# EAGLE design MBO (EAGLE 7.4.0)
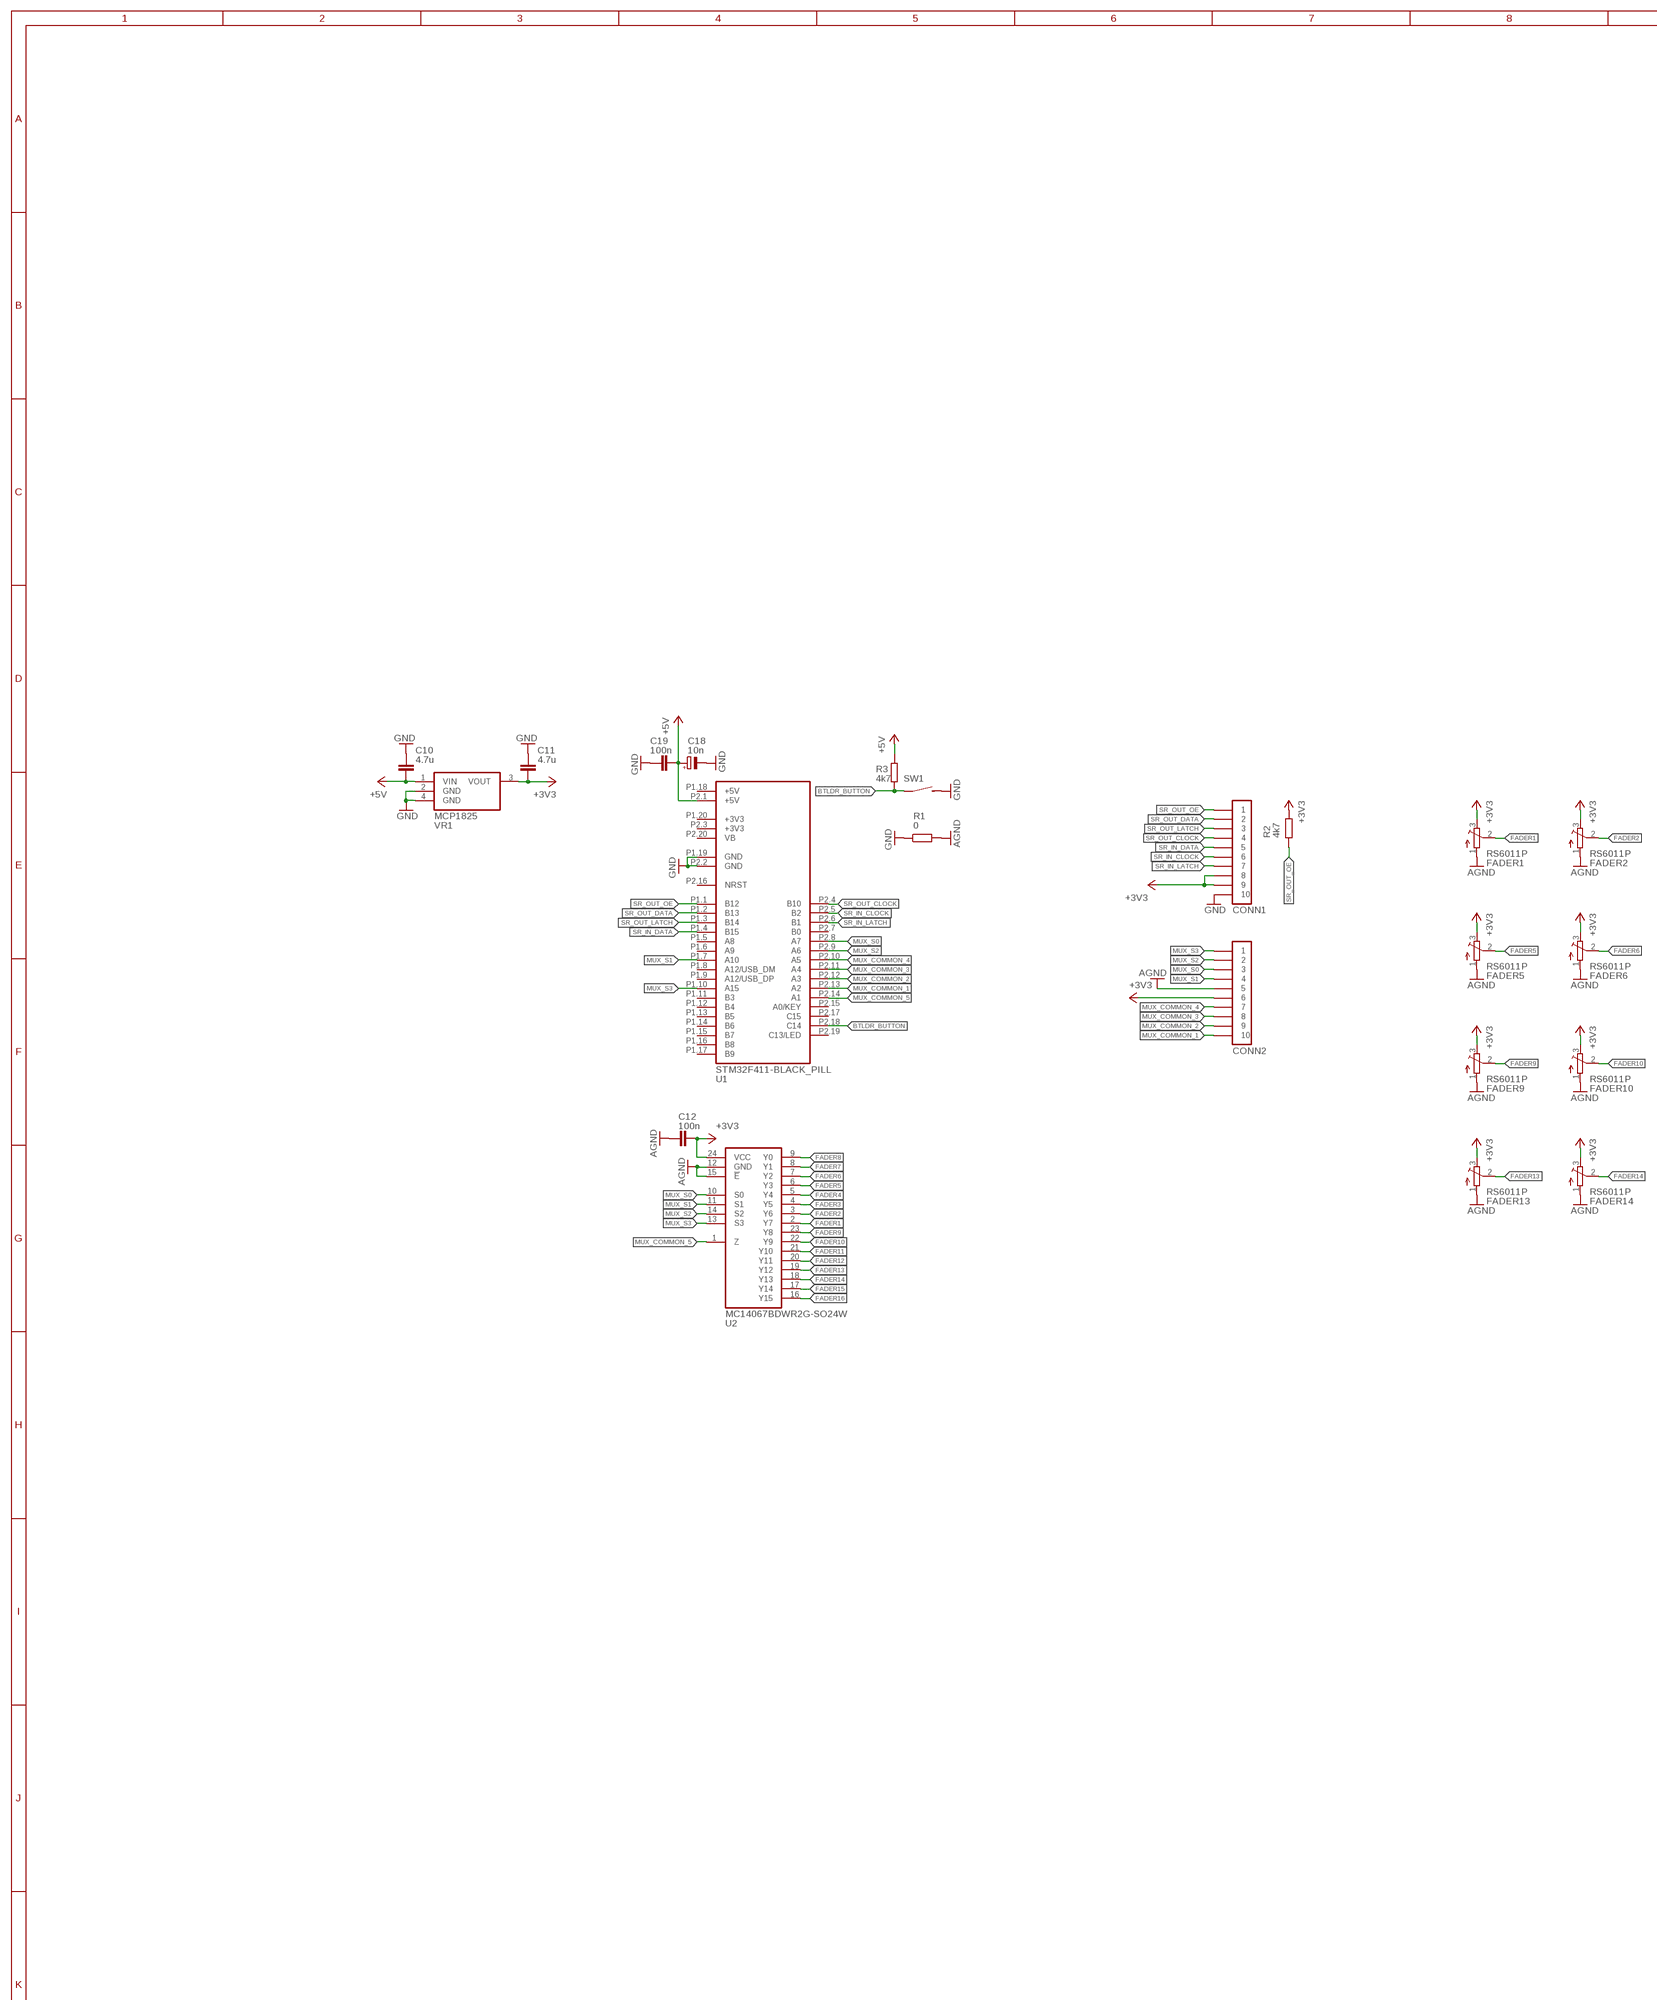
[diagram p0: schematic, sheet 1, part 1 of 3]
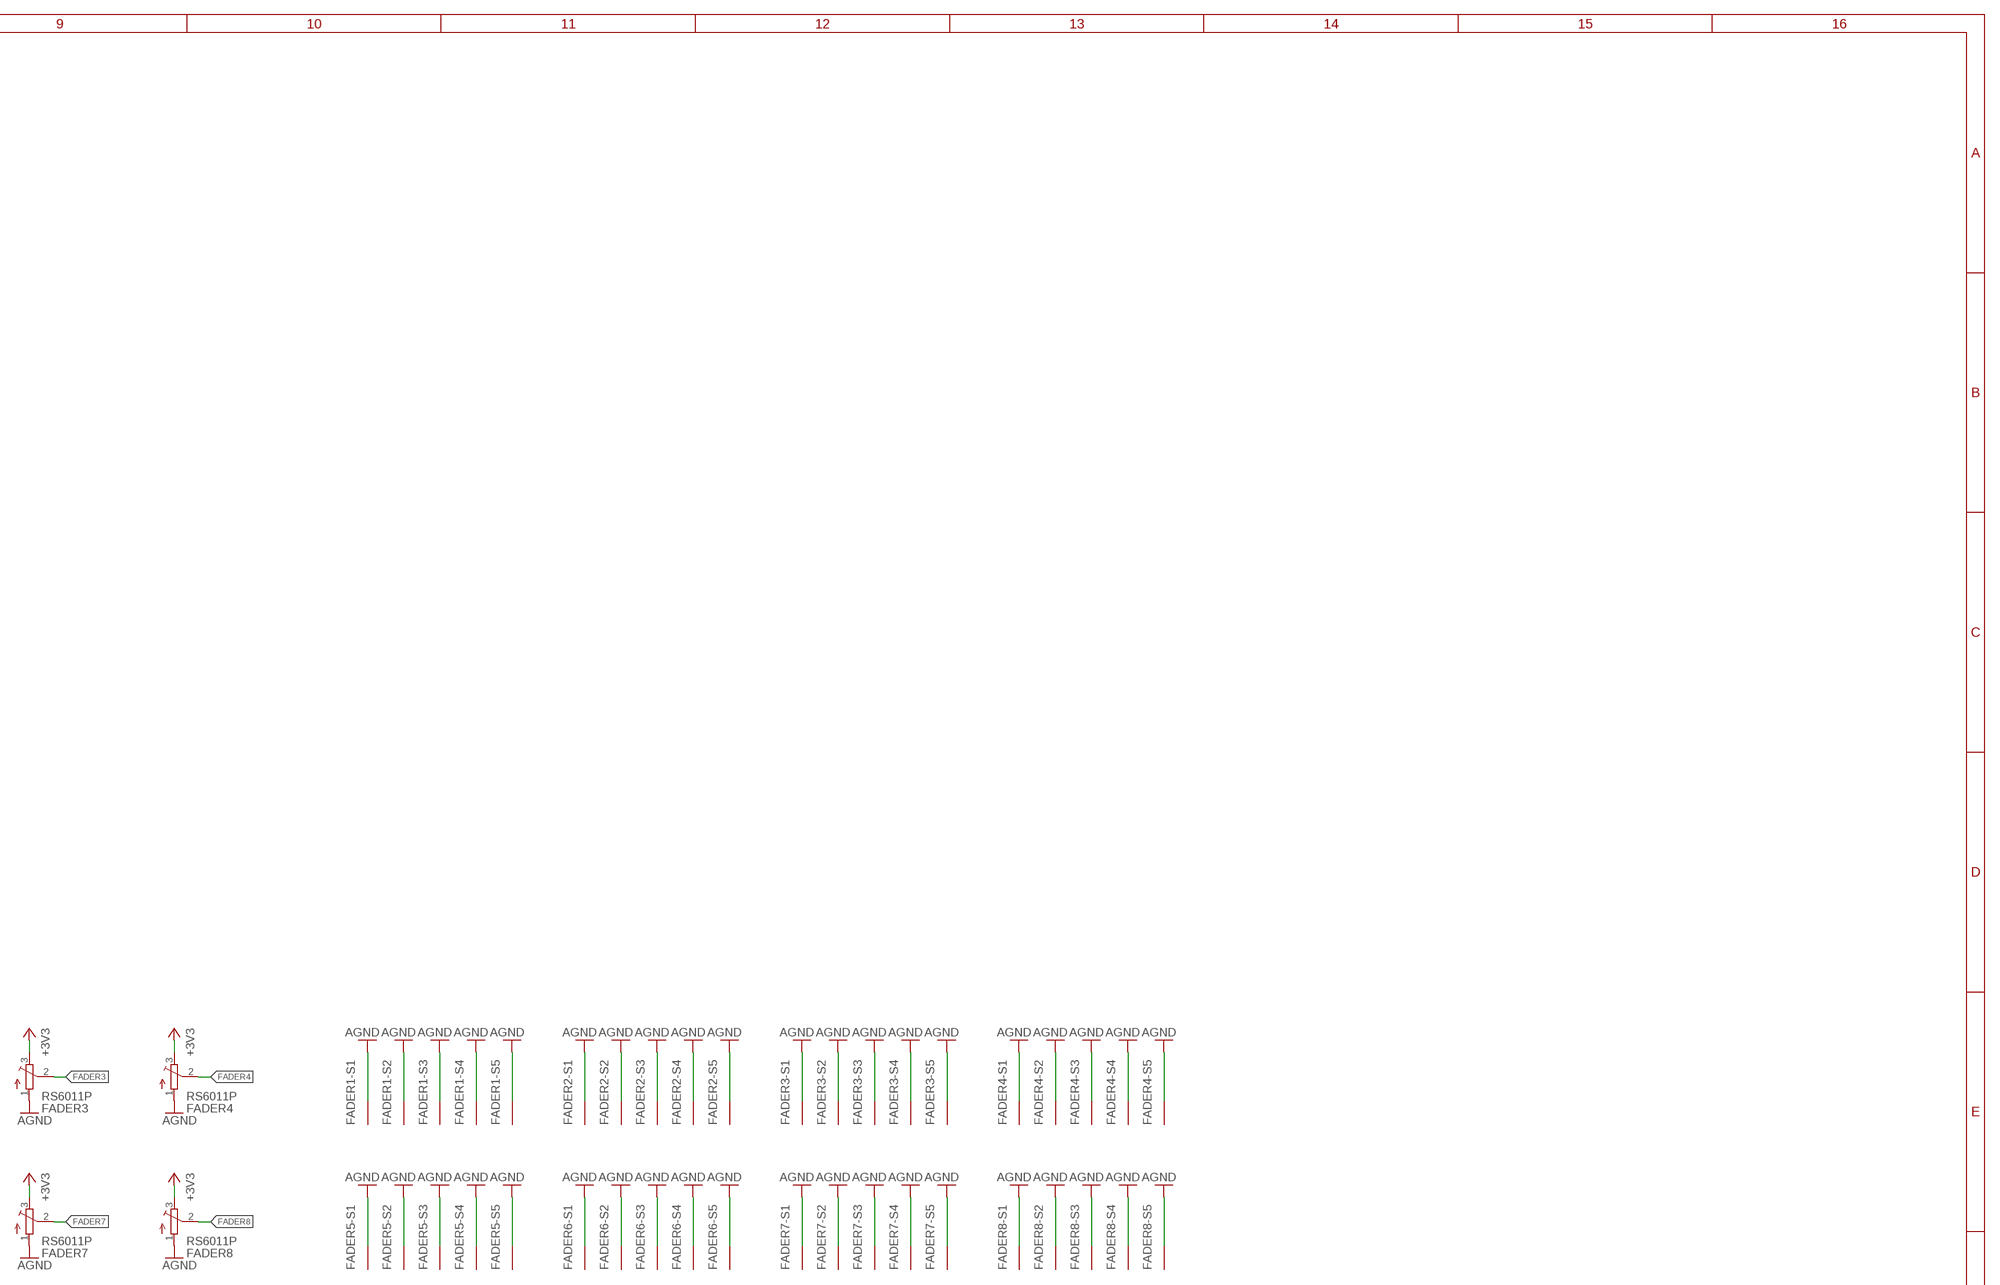
[diagram p1: schematic, sheet 1, part 2 of 3]
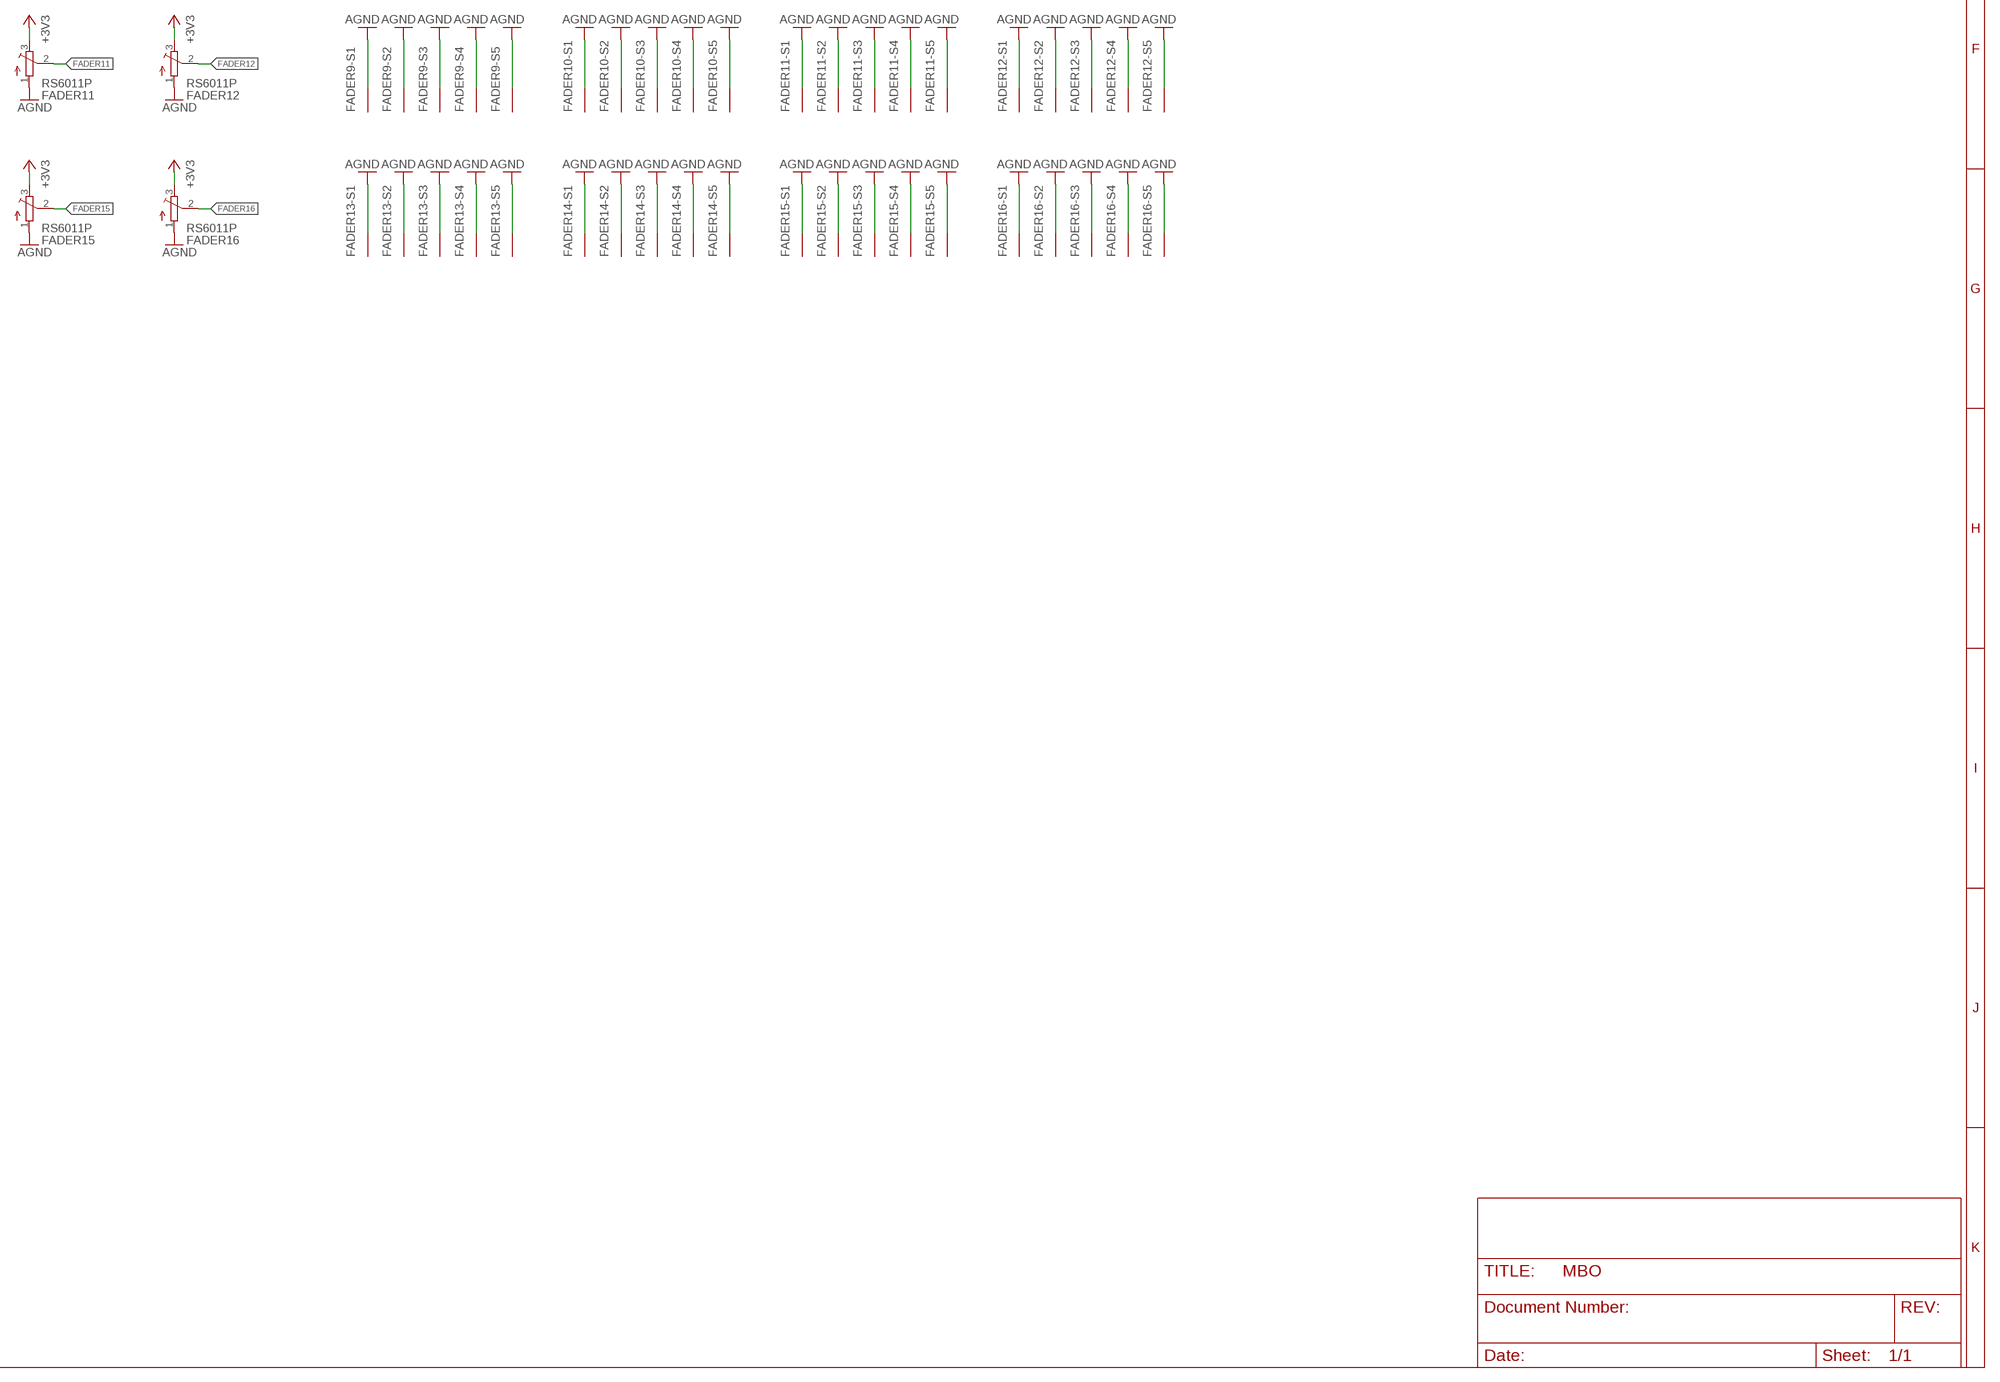
[diagram p2: schematic, sheet 1, part 3 of 3]

## Parts
C10  4.7u  CAPACITOR-0805  [C0805]
C11  4.7u  CAPACITOR-0805  [C0805]
C12  100n  CAPACITOR-0805  [C0805]
C18  10n  ELECTROLYTIC_CAPACITOR-C-TH-E-0401  [C-TH-E-0401]
C19  100n  CAPACITOR-0805  [C0805]
CONN1  PINHD-1X10-FFC-1MM-Z  [MOLEX-52271-1079]
CONN2  PINHD-1X10-FFC-1MM-Z  [MOLEX-52271-1079]
FADER1  RS6011P  [RS6011*P]
FADER2  RS6011P  [RS6011*P]
FADER3  RS6011P  [RS6011*P]
FADER4  RS6011P  [RS6011*P]
FADER5  RS6011P  [RS6011*P]
FADER6  RS6011P  [RS6011*P]
FADER7  RS6011P  [RS6011*P]
FADER8  RS6011P  [RS6011*P]
FADER9  RS6011P  [RS6011*P]
FADER10  RS6011P  [RS6011*P]
FADER11  RS6011P  [RS6011*P]
FADER12  RS6011P  [RS6011*P]
FADER13  RS6011P  [RS6011*P]
FADER14  RS6011P  [RS6011*P]
FADER15  RS6011P  [RS6011*P]
FADER16  RS6011P  [RS6011*P]
R1  0  RESISTOR-0805  [R0805]
R2  4k7  RESISTOR-0805  [R0805]
R3  4k7  RESISTOR-0805  [R0805]
SW1  SWITCH-TACT-TH-6X6MM  [TACT_SW_6X6MM]
U1  STM32F411-BLACK_PILL  [STM32F411-BLACK_PILL]
U2  MC14067BDWR2G-SO24W  [SO24-W]
VR1  MCP1825  [SOT223]

## Nets
+3V3: C11.1 C12.1 CONN1.8 CONN1.9 CONN2.6 FADER1.3 FADER2.3 FADER3.3 FADER4.3 FADER5.3 FADER6.3 FADER7.3 FADER8.3 FADER9.3 FADER10.3 FADER11.3 FADER12.3 FADER13.3 FADER14.3 FADER15.3 FADER16.3 R2.2 U2.24(VCC) VR1.3(VOUT)
+5V: C10.1 C18.+ C19.1 R3.1 U1.P2.1(+5V) VR1.1(VIN)
AGND: C12.2 CONN2.5 FADER1.1 FADER1.S1(S) FADER1.S2(S) FADER1.S3(S) FADER1.S4(S) FADER1.S5(S) FADER2.1 FADER2.S1(S) FADER2.S2(S) FADER2.S3(S) FADER2.S4(S) FADER2.S5(S) FADER3.1 FADER3.S1(S) FADER3.S2(S) FADER3.S3(S) FADER3.S4(S) FADER3.S5(S) FADER4.1 FADER4.S1(S) FADER4.S2(S) FADER4.S3(S) FADER4.S4(S) FADER4.S5(S) FADER5.1 FADER5.S1(S) FADER5.S2(S) FADER5.S3(S) FADER5.S4(S) FADER5.S5(S) FADER6.1 FADER6.S1(S) FADER6.S2(S) FADER6.S3(S) FADER6.S4(S) FADER6.S5(S) FADER7.1 FADER7.S1(S) FADER7.S2(S) FADER7.S3(S) FADER7.S4(S) FADER7.S5(S) FADER8.1 FADER8.S1(S) FADER8.S2(S) FADER8.S3(S) FADER8.S4(S) FADER8.S5(S) FADER9.1 FADER9.S1(S) FADER9.S2(S) FADER9.S3(S) FADER9.S4(S) FADER9.S5(S) FADER10.1 FADER10.S1(S) FADER10.S2(S) FADER10.S3(S) FADER10.S4(S) FADER10.S5(S) FADER11.1 FADER11.S1(S) FADER11.S2(S) FADER11.S3(S) FADER11.S4(S) FADER11.S5(S) FADER12.1 FADER12.S1(S) FADER12.S2(S) FADER12.S3(S) FADER12.S4(S) FADER12.S5(S) FADER13.1 FADER13.S1(S) FADER13.S2(S) FADER13.S3(S) FADER13.S4(S) FADER13.S5(S) FADER14.1 FADER14.S1(S) FADER14.S2(S) FADER14.S3(S) FADER14.S4(S) FADER14.S5(S) FADER15.1 FADER15.S1(S) FADER15.S2(S) FADER15.S3(S) FADER15.S4(S) FADER15.S5(S) FADER16.1 FADER16.S1(S) FADER16.S2(S) FADER16.S3(S) FADER16.S4(S) FADER16.S5(S) R1.2 U2.12(GND) U2.15(!E)
BTLDR_BUTTON: R3.2 SW1.A1 U1.P2.18(C14)
FADER1: FADER1.2 U2.2(Y7)
FADER2: FADER2.2 U2.3(Y6)
FADER3: FADER3.2 U2.4(Y5)
FADER4: FADER4.2 U2.5(Y4)
FADER5: FADER5.2 U2.6(Y3)
FADER6: FADER6.2 U2.7(Y2)
FADER7: FADER7.2 U2.8(Y1)
FADER8: FADER8.2 U2.9(Y0)
FADER9: FADER9.2 U2.23(Y8)
FADER10: FADER10.2 U2.22(Y9)
FADER11: FADER11.2 U2.21(Y10)
FADER12: FADER12.2 U2.20(Y11)
FADER13: FADER13.2 U2.19(Y12)
FADER14: FADER14.2 U2.18(Y13)
FADER15: FADER15.2 U2.17(Y14)
FADER16: FADER16.2 U2.16(Y15)
GND: C10.2 C11.2 C18.- C19.2 CONN1.10 R1.1 SW1.B1 U1.P1.19(GND) U1.P2.2(GND) VR1.2(GND) VR1.4(GND)
MUX_COMMON_1: CONN2.10 U1.P2.13(A2)
MUX_COMMON_2: CONN2.9 U1.P2.12(A3)
MUX_COMMON_3: CONN2.8 U1.P2.11(A4)
MUX_COMMON_4: CONN2.7 U1.P2.10(A5)
MUX_COMMON_5: U1.P2.14(A1) U2.1(Z)
MUX_S0: CONN2.3 U1.P2.8(A7) U2.10(S0)
MUX_S1: CONN2.4 U1.P1.7(A10) U2.11(S1)
MUX_S2: CONN2.2 U1.P2.9(A6) U2.14(S2)
MUX_S3: CONN2.1 U1.P1.10(A15) U2.13(S3)
SR_IN_CLOCK: CONN1.6 U1.P2.5(B2)
SR_IN_DATA: CONN1.5 U1.P1.4(B15)
SR_IN_LATCH: CONN1.7 U1.P2.6(B1)
SR_OUT_CLOCK: CONN1.4 U1.P2.4(B10)
SR_OUT_DATA: CONN1.2 U1.P1.2(B13)
SR_OUT_LATCH: CONN1.3 U1.P1.3(B14)
SR_OUT_OE: CONN1.1 R2.1 U1.P1.1(B12)
Unconnected: U1.P1.5(A8) U1.P1.6(A9) U1.P1.8(A12/USB_DM) U1.P1.9(A12/USB_DP) U1.P1.11(B3) U1.P1.12(B4) U1.P1.13(B5) U1.P1.14(B6) U1.P1.15(B7) U1.P1.16(B8) U1.P1.17(B9) U1.P1.18(+5V) U1.P1.20(+3V3) U1.P2.3(+3V3) U1.P2.7(B0) U1.P2.15(A0/KEY) U1.P2.16(NRST) U1.P2.17(C15) U1.P2.19(C13/LED) U1.P2.20(VB)

## Library data of the parts
C10-C12 C19 = igor_lbr:CAPACITOR: Capacitor
C18 = igor_lbr:ELECTROLYTIC_CAPACITOR: Electrolytic capacitor
CONN1 CONN2 = igor_lbr:PINHD-1X10: Pin header; MANUFACTURER: Molex; MPN: 52271-1079
FADER1-FADER16 = igor_lbr:RS6011*P: Potentiometer
R1-R3 = igor_lbr:RESISTOR: Resistor
SW1 = igor_lbr:SWITCH: Switch
U1 = igor_lbr:STM32F411-BLACK_PILL: STM32F411 Black Pill development board
U2 = igor_lbr:MC14067BDWR2G: 16-Channel Analog Multiplexer/Demultiplexer; MANUFACTURER: ON Semiconductor; MPN: MC14067BDWR2G
VR1 = igor_lbr:MCP1825: 500 mA, Low Voltage, Low Quiescent Current LDO Regulator; MANUFACTURER: Microchip; MPN: MCP1825S-3302E/DB

## Board
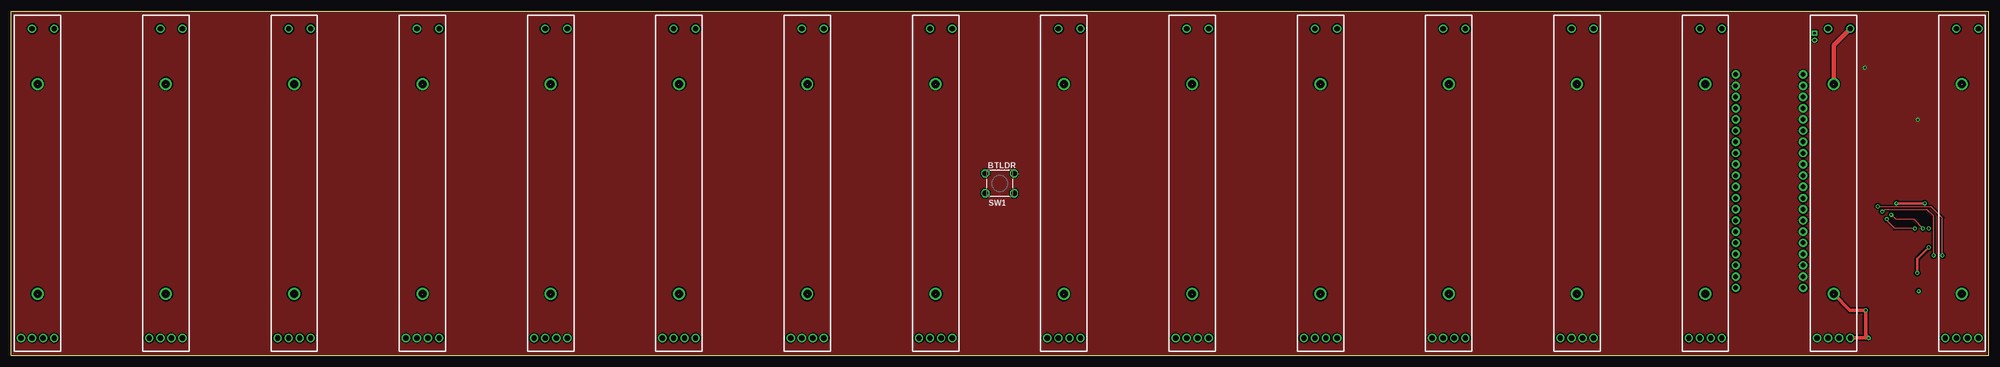
[diagram p3: board, top side]
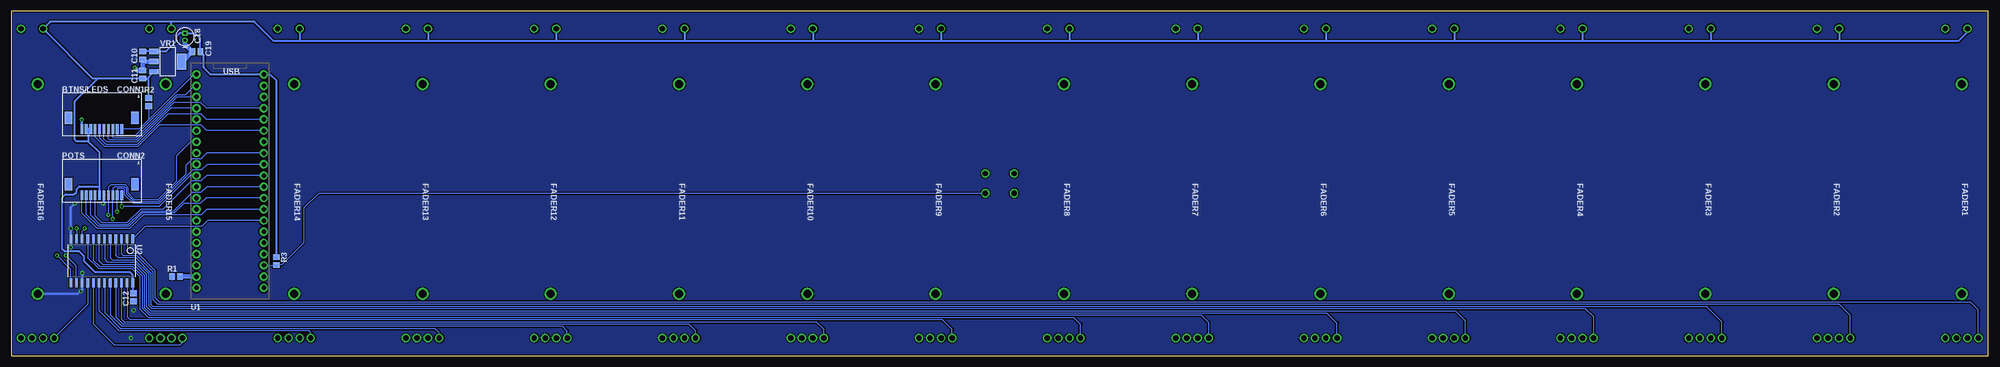
[diagram p4: board, bottom side, seen from below]

Size 447 x 78 mm. Coordinates in mm from the lower left corner, seen from the top.
Outline: 0,0 0,78 447,78 447,0 0,0
Copper layers (1*16): Top 0.035mm / dielectric 1.5mm / Bottom 0.035mm
Design rules "smiery *": minimum track width 8mil, minimum drill 12mil, track to track 6mil, track to pad 5mil, pad to pad 5mil, via to via 6mil, smd to smd 0mil, copper to edge 12mil, drill to drill 10mil, minimum pad ring 13mil, minimum via ring 10mil, stop-mask expansion 2mil, vias tented up to drill 25mil, thermal gap 10mil

### Footprints (pad centres in the part's own frame; a part is rotated, then mirrored left to right if it is on the bottom)
C0805 = smd 1.27 x 1.524: 1 -0.9,0; 2 0.9,0
C-TH-E-0401 = drill 0.5 square: + 0.77,0 | drill 0.5: - -0.77,0
MOLEX-52271-1079 = smd 0.6 x 2.2: 1 -4.5,3.5; 2 -3.5,3.5; 3 -2.5,3.5; 4 -1.5,3.5; 5 -0.5,3.5; 6 0.5,3.5; 7 1.5,3.5; 8 2.5,3.5; 9 3.5,3.5; 10 4.5,3.5 | smd 1.65 x 2.8: S1 -7.5,1; S2 7.5,1
RS6011*P = drill 1.2: 1 -35,1.25; 2 -35,3.75; 3 35,1.25; S1 -35,-1.25; S2 -35,-3.75; S5 35,-3.75 | drill 1.8: S3 -25,0; S4 22.5,0
R0805 = smd 1.27 x 1.524: 1 -0.9,0; 2 0.9,0
TACT_SW_6X6MM = drill 1.2 octagon: A1 3.25,-2.25; A2 -3.25,-2.25; B1 3.25,2.25; B2 -3.25,2.25
STM32F411-BLACK_PILL = drill 1.016 pad 1.88: P1.1 -7.62,24.13; P1.2 -7.62,21.59; P1.3 -7.62,19.05; P1.4 -7.62,16.51; P1.5 -7.62,13.97; P1.6 -7.62,11.43; P1.7 -7.62,8.89; P1.8 -7.62,6.35; P1.9 -7.62,3.81; P1.10 -7.62,1.27; P1.11 -7.62,-1.27; P1.12 -7.62,-3.81; P1.13 -7.62,-6.35; P1.14 -7.62,-8.89; P1.15 -7.62,-11.43; P1.16 -7.62,-13.97; P1.17 -7.62,-16.51; P1.18 -7.62,-19.05; P1.19 -7.62,-21.59; P1.20 -7.62,-24.13; P2.1 7.62,24.13; P2.2 7.62,21.59; P2.3 7.62,19.05; P2.4 7.62,16.51; P2.5 7.62,13.97; P2.6 7.62,11.43; P2.7 7.62,8.89; P2.8 7.62,6.35; P2.9 7.62,3.81; P2.10 7.62,1.27; P2.11 7.62,-1.27; P2.12 7.62,-3.81; P2.13 7.62,-6.35; P2.14 7.62,-8.89; P2.15 7.62,-11.43; P2.16 7.62,-13.97; P2.17 7.62,-16.51; P2.18 7.62,-19.05; P2.19 7.62,-21.59; P2.20 7.62,-24.13
SO24-W = smd 2.032 x 0.6: 1 -4.975,6.985; 2 -4.975,5.715; 3 -4.975,4.445; 4 -4.975,3.175; 5 -4.975,1.905; 6 -4.975,0.635; 7 -4.975,-0.635; 8 -4.975,-1.905; 9 -4.975,-3.175; 10 -4.975,-4.445; 11 -4.975,-5.715; 12 -4.975,-6.985; 13 4.975,-6.985; 14 4.975,-5.715; 15 4.975,-4.445; 16 4.975,-3.175; 17 4.975,-1.905; 18 4.975,-0.635; 19 4.975,0.635; 20 4.975,1.905; 21 4.975,3.175; 22 4.975,4.445; 23 4.975,5.715; 24 4.975,6.985
SOT223 = smd 2.235 x 1.219: 1 -3.099,2.311; 2 -3.099,0; 3 -3.099,-2.311 | smd 2.2 x 3.6: 4 3.099,0

### Placement (x,y rotation side)
C10  417.25,67.95 270 bottom
C11  417.25,63.65 90 bottom
C12  419.3,13.2 270 bottom
C18  407.7,72.2 90 bottom
C19  405.1,68.8 180 bottom
CONN1  426.5,54.8 180 bottom
CONN2  426.5,39.8 180 bottom
FADER1  6,39 90 top
FADER2  35,39 90 top
FADER3  64,39 90 top
FADER4  93,39 90 top
FADER5  122,39 90 top
FADER6  151,39 90 top
FADER7  180,39 90 top
FADER8  209,39 90 top
FADER9  238,39 90 top
FADER10  267,39 90 top
FADER11  296,39 90 top
FADER12  325,39 90 top
FADER13  354,39 90 top
FADER14  383,39 90 top
FADER15  412,39 90 top
FADER16  441,39 90 top
R1  409.7,17.9 180 bottom
R2  415.9,57.4 90 bottom
R3  387,21.4 270 bottom
SW1  223.5,39 0 top
U1  397.5,39.5 0 bottom
U2  426.5,21.5 270 bottom
VR1  411.6,66.59 0 bottom

### Tracks (layer width: path | path; a pad name or v marks a point on that pad's centre or on a via)
+3V3
  Bottom 0.406: CONN1.9 429.5,51.3 | 429.5,51.3 CONN1.8 | FADER1.3 4.75,73.25 6.8,71.2 33.8,71.2 | 33.8,71.2 62.7,71.2 | FADER2.3 33.75,71.25 33.8,71.2 | FADER3.3 62.75,71.25 62.7,71.2 | 149.8,71.2 178.7,71.2 | FADER6.3 149.75,71.25 149.8,71.2 | FADER7.3 178.75,71.25 178.7,71.2 | 265.8,71.2 294.7,71.2 | FADER10.3 265.75,71.25 265.8,71.2 | FADER11.3 294.75,71.25 294.7,71.2 | FADER14.3 381.75,71.25 381.8,71.2 | C12.1 419.51,14.31 U2.24 419.51,18.32 420.1,18.9 428,18.9 430.5,21.4 430.5,22.5 431.6,23.6 434.9,23.6 435.4,24.1 435.4,35.8 434.7,36.5 432.8,36.5 432.2,37.1 432.2,37.7 431.6,38.3 427.1,38.3 427,38.4 | 62.7,71.2 91.7,71.2 | 91.7,71.2 120.7,71.2 | 120.7,71.2 149.8,71.2 | 178.7,71.2 207.7,71.2 | 207.7,71.2 236.7,71.2 | 236.7,71.2 265.8,71.2 | 294.7,71.2 323.8,71.2 | 323.8,71.2 352.7,71.2 | 352.7,71.2 381.8,71.2 | FADER4.3 91.75,71.25 91.7,71.2 | FADER5.3 120.75,71.25 120.7,71.2 | FADER8.3 207.75,71.25 207.7,71.2 | FADER9.3 236.75,71.25 236.7,71.2 | FADER12.3 323.75,71.25 323.8,71.2 | FADER13.3 352.75,71.25 352.7,71.2 | CONN2.6 427,38.4 | 427,38.4 427,46 429.5,48.5 | 381.8,71.2 387.6,71.2 392,75.6 410.8,75.6 | 429.5,48.5 432.2,48.5 432.6,48.9 432.6,57.6 427.45,62.75 | 429.5,51.3 429.5,48.5 | 416.23,62.75 C11.1 427.45,62.75 | VR1.3 416.23,62.75 | R2.2 415.9,62.42 416.23,62.75 | 427.45,62.75 428.5,62.75 FADER16.3 438.15,75.6 410.8,75.6 | FADER15.3 410.75,75.55 410.8,75.6
+5V
  Bottom 0.406: R3.1 387,62.2 388.43,63.63 U1.P2.1 401.83,63.63 403.4,65.2 403.4,68 C19.1 404.2,71.8 405.37,72.97 C18.+ 408.83,72.97 409.5,72.3 409.5,71.3 411.9,68.9 VR1.1 417.2,68.9 C10.1
AGND  (via drill 0.4 pad 0.6)
  Top 0.61: v430.9,18.7 430.9,21.9 v433.5,24.5 | v426.2,34.5 v432.6,34.5
  Top 0.813: FADER15.S3 415.7,10.3 v419.3,10.3 419.3,4.6 v419.9,4 FADER15.S2
  Top 1.016: FADER15.S4 412,70.25 FADER15.S5
  Bottom 0.61: FADER16.S3 431.9,14 430.94,14.96 U2.15 430.94,18.66 v430.9,18.7 | v433.5,24.5 433.49,24.52 U2.12 433.49,28.79 v433.5,28.8 433.5,33.6 v432.6,34.5 | CONN2.5 426,34.7 v426.2,34.5
  other vias: 431.2,14.6
  pour Bottom (isolate 0.305): 0,78 447,78 447,0 0,0
BTLDR_BUTTON
  Bottom 0.203: SW1.A1 377.45,36.75 380.8,33.4 380.8,25.5 385.8,20.5 R3.2 387.05,20.45 U1.P2.18
FADER1
  Bottom 0.254: U2.2 420.79,23.59 420.3,23.1 418.3,23.1 414.4,19.2 414.4,13.1 413.4,12.1 4,12.1 2.25,10.35 FADER1.2
FADER2
  Bottom 0.254: U2.3 422.06,23.16 421.5,22.6 418.5,22.6 414.9,19 414.9,12.7 413.8,11.6 33.7,11.6 31.25,9.15 FADER2.2
FADER3
  Bottom 0.254: U2.4 423.32,22.73 422.7,22.1 418.7,22.1 415.4,18.8 415.4,11.6 414.9,11.1 63.7,11.1 60.25,7.65 FADER3.2
FADER4
  Bottom 0.254: U2.5 424.6,22.2 424,21.6 418.9,21.6 415.9,18.6 415.9,11.4 415.1,10.6 91.1,10.6 89.25,8.75 FADER4.2
FADER5
  Bottom 0.254: U2.6 425.87,21.86 425.1,21.1 419,21.1 416.4,18.5 416.4,11.2 415.3,10.1 120.4,10.1 118.25,7.95 FADER5.2
FADER6
  Bottom 0.254: U2.7 427.13,21.54 426.2,20.6 419.2,20.6 416.9,18.3 416.9,11 415.5,9.6 149.5,9.6 147.25,7.35 FADER6.2
FADER7
  Bottom 0.254: U2.8 428.4,21.61 426.9,20.1 419.4,20.1 417.4,18.1 417.4,10.8 415.7,9.1 177.9,9.1 176.25,7.45 FADER7.2
FADER8
  Bottom 0.254: U2.9 429.68,22.18 427.1,19.6 419.6,19.6 417.9,17.9 417.9,10.6 415.9,8.6 206.7,8.6 205.25,7.15 FADER8.2
FADER9
  Bottom 0.254: U2.23 420.79,8.79 420.1,8.1 236.4,8.1 234.25,5.95 FADER9.2
FADER10
  Bottom 0.254: U2.22 422.06,8.36 421.3,7.6 264.9,7.6 263.25,5.95 FADER10.2
FADER11
  Bottom 0.254: U2.21 423.32,8.82 421.6,7.1 293.7,7.1 292.25,5.65 FADER11.2
FADER12
  Bottom 0.254: U2.20 424.6,9.29 421.9,6.6 322.3,6.6 321.25,5.55 FADER12.2
FADER13
  Bottom 0.254: U2.19 425.87,9.77 422.2,6.1 351.1,6.1 350.25,5.25 FADER13.2
FADER14
  Bottom 0.254: U2.18 427.13,10.23 422.5,5.6 379.6,5.6 379.25,5.25 FADER14.2
FADER15
  Bottom 0.254: FADER15.2 408.25,3.05 408.9,2.4 423.6,2.4 428.4,7.21 U2.17
FADER16
  Bottom 0.254: U2.16 429.68,11.57 FADER16.2
GND  (via drill 0.4 pad 0.6)
  Bottom 0.61: CONN1.10 v431,53.4
  Bottom 1.016: v419.1,65.2 418.45,64.55 C11.2 C10.2 416.79,66.59 VR1.2 | U1.P1.19 R1.1 | 408.9,66.19 VR1.4 408.21,66.59 C19.2 407.7,70.5 C18.-
  pour Top (isolate 0.305): 0,78 447,78 447,0 0,0
MUX_COMMON_1
  Bottom 0.203: U1.P2.13 402.75,33.15 404,31.9 417.1,31.9 420.2,28.8 427.5,28.8 431,32.3 CONN2.10
MUX_COMMON_2
  Bottom 0.203: U1.P2.12 402.91,35.69 404.2,34.4 408,34.4 410.1,32.3 417.3,32.3 420.4,29.2 427.2,29.2 430,32 CONN2.9
MUX_COMMON_3
  Bottom 0.203: U1.P2.11 402.77,38.23 404.1,36.9 406.1,36.9 410.3,32.7 417.5,32.7 420.6,29.6 426.8,29.6 429,31.8 CONN2.8
MUX_COMMON_4
  Bottom 0.203: U1.P2.10 402.83,40.77 404.1,39.5 406.3,39.5 412.7,33.1 417.7,33.1 420.8,30 426.4,30 428,31.6 CONN2.7
MUX_COMMON_5
  Bottom 0.203: U1.P2.14 402.59,30.61 403.9,29.3 416.69,29.3 U2.1
MUX_S0  (via drill 0.4 pad 0.6)
  Top 0.254: v430.4,28.8 425.8,28.8 424,30.6 v424,30.9
  Bottom 0.203: CONN2.3 424,37.8 423.6,38.2 421.3,38.2 420.9,37.8 420.9,36.6 419.1,34.8 413.7,34.8 407.5,41 407.5,43 406,44.5 404.1,44.5 402.75,45.85 U1.P2.8
  Bottom 0.254: U2.10 430.94,28.25 v430.4,28.8 | v424,30.9 CONN2.3
MUX_S1  (via drill 0.4 pad 0.6)
  Top 0.254: v425,31.9 426,30.9 430.1,30.9 v432.2,28.8
  Bottom 0.203: CONN2.4 425,38.1 424.5,38.6 421.1,38.6 420.5,38 420.5,36.8 419,35.3 413.8,35.3 409.7,39.4 409.7,45.2 406.51,48.39 U1.P1.7
  Bottom 0.254: CONN2.4 v425,31.9 | v432.2,28.8 U2.11
MUX_S2  (via drill 0.4 pad 0.6)
  Top 0.254: v434.6,22.7 434.6,31.6 433.2,33 423.4,33 v423,32.6
  Bottom 0.203: CONN2.2 423,37.7 422.9,37.8 421.5,37.8 421.3,37.6 421.3,36.4 419.3,34.4 413.5,34.4 405.9,42 404,42 402.69,43.31 U1.P2.9
  Bottom 0.254: U2.14 432.21,20.32 v434.6,22.7 | v423,32.6 CONN2.2
MUX_S3  (via drill 0.4 pad 0.6)
  Top 0.254: v436.6,22.7 436.6,31.2 434.1,33.7 422.1,33.7 v422,33.8
  Bottom 0.203: v422,33.8 413.5,33.8 406.53,40.77 U1.P1.10
  Bottom 0.254: U2.13 433.49,19.59 v436.6,22.7 | v422,33.8 CONN2.1
SR_IN_CLOCK
  Bottom 0.203: U1.P2.5 402.77,53.47 404,54.7 411.6,54.7 418.5,47.8 425.5,47.8 427,49.3 CONN1.6
SR_IN_DATA
  Bottom 0.203: U1.P1.4 410.89,56.01 418.6,48.3 425.3,48.3 426,49 CONN1.5
SR_IN_LATCH
  Bottom 0.203: U1.P2.6 402.73,50.93 404,52.2 413.5,52.2 418.4,47.3 425.8,47.3 428,49.5 CONN1.7
SR_OUT_CLOCK
  Bottom 0.203: U1.P2.4 402.81,56.01 404.1,57.3 410.2,57.3 418.7,48.8 424.7,48.8 425,49.1 CONN1.4
SR_OUT_DATA
  Bottom 0.203: U1.P1.2 405.51,61.09 407.6,59 409.7,59 418.9,49.8 422.9,49.8 423,49.9 CONN1.2
SR_OUT_LATCH
  Bottom 0.203: U1.P1.3 409.55,58.55 418.8,49.3 423.8,49.3 424,49.5 CONN1.3
SR_OUT_OE
  Bottom 0.203: U1.P1.1 405.67,63.63 415.9,53.4 | CONN1.1 418,51.3 415.9,53.4 | R2.1 415.9,53.4

### Text on the board
tNames: BTLDR
bNames: BTNS/LEDS | POTS